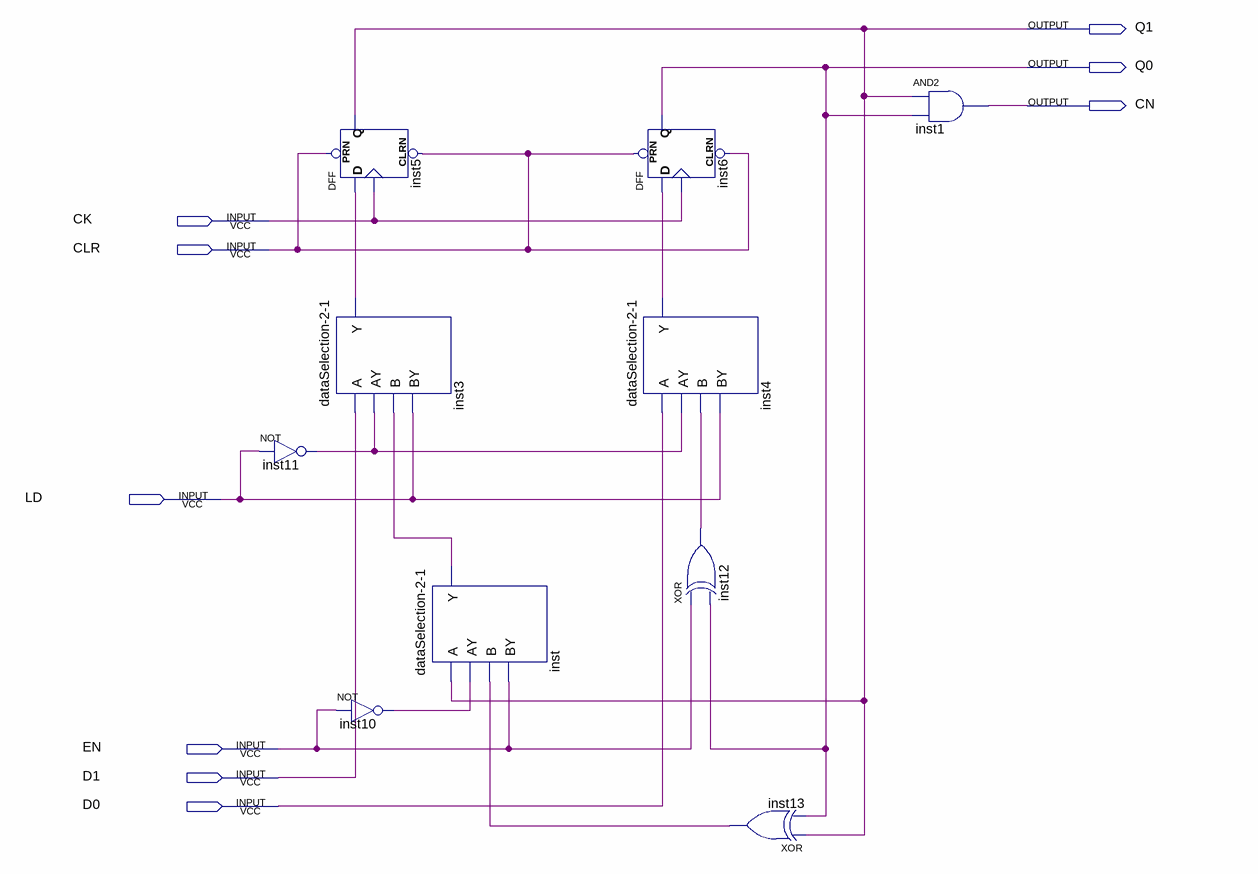
[diagram p0: schematic sheet]
// Quartus schematic synchroCount4.bdf as structural Verilog: 10 symbols, 9 pins
module synchroCount4 (
  input  CK,
  input  CLR,
  input  LD,
  input  EN,
  input  D1,
  input  D0,
  output Q1,
  output Q0,
  output CN
);

  wire inst3_y, inst4_y, inst10_out, inst11_out, inst12_out, inst13_out, inst_y;

  not inst11 (inst11_out, LD);
  DFF inst5 (.CLRN(CLR), .CLK(CK), .D(inst3_y), .PRN(CLR), .Q(Q1));
  \dataSelection-2-1  inst3 (.A(D1), .AY(inst11_out), .B(inst_y), .BY(LD), .Y(inst3_y));
  not inst10 (inst10_out, EN);
  \dataSelection-2-1  inst (.A(Q1), .AY(inst10_out), .B(inst13_out), .BY(EN), .Y(inst_y));
  DFF inst6 (.CLRN(CLR), .CLK(CK), .D(inst4_y), .PRN(CLR), .Q(Q0));
  \dataSelection-2-1  inst4 (.A(D0), .AY(inst11_out), .B(inst12_out), .BY(LD), .Y(inst4_y));
  xor inst12 (inst12_out, EN, Q0);
  xor inst13 (inst13_out, Q1, Q0);
  and inst1 (CN, Q1, Q0);
endmodule
